# EAGLE schematic Jig-Top-Layer (EAGLE 7.6.0)
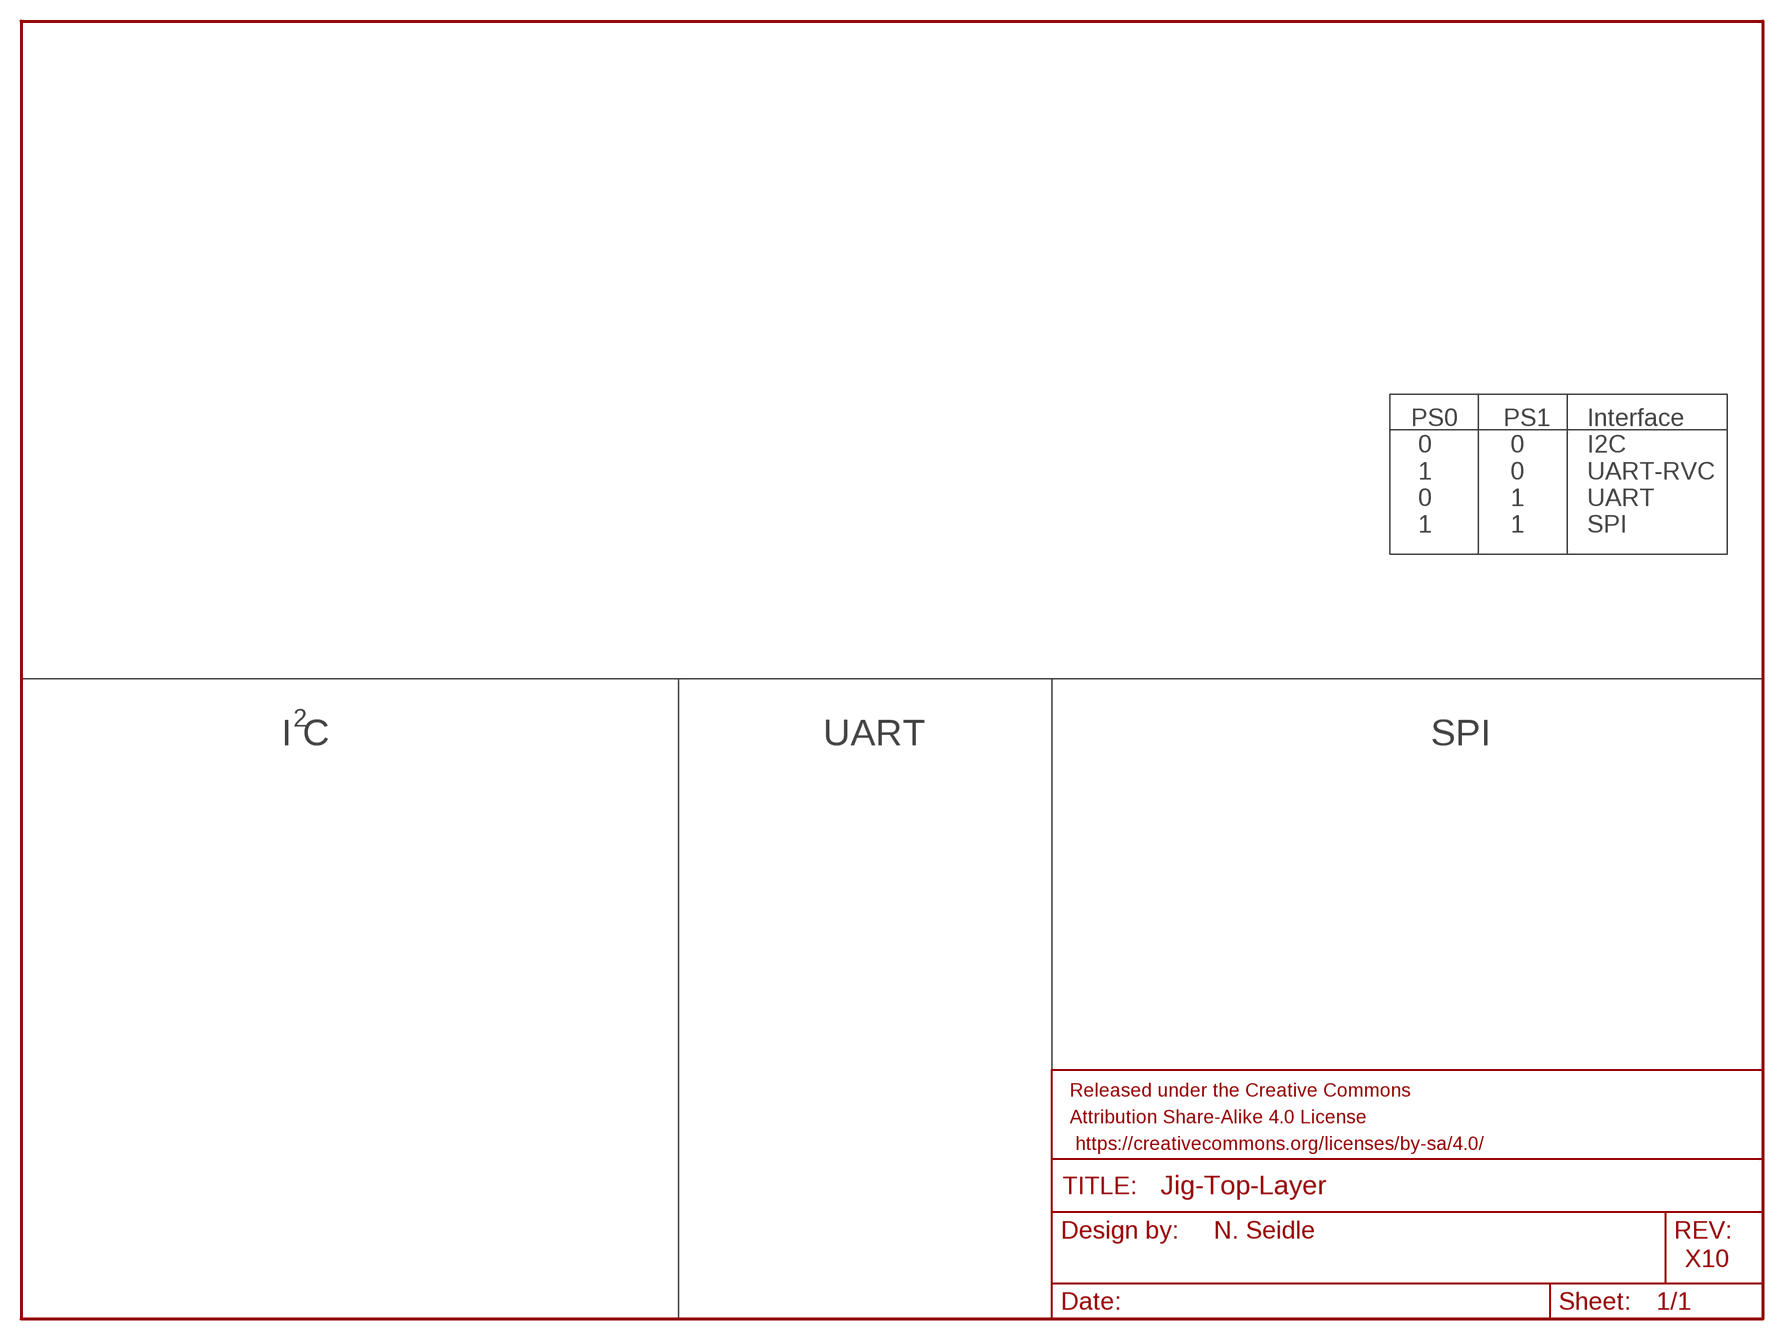
[diagram p0: schematic, sheet 1]

## Parts
FRAME1  FRAME-LETTER  [CREATIVE_COMMONS]

## Notes on the sheet
- PS0
   0
   1
   0
   1
- PS1
   0
   0
   1
   1
- Interface
  I2C
  UART-RVC
  UART
  SPI
- 2
- I C | UART | SPI
- N. Seidle
- X10

## Library data of the parts
FRAME1 = SparkFun-Aesthetics:FRAME-LETTER: Schematic Frame - Letter Standard 8.5x11 US Letter frame